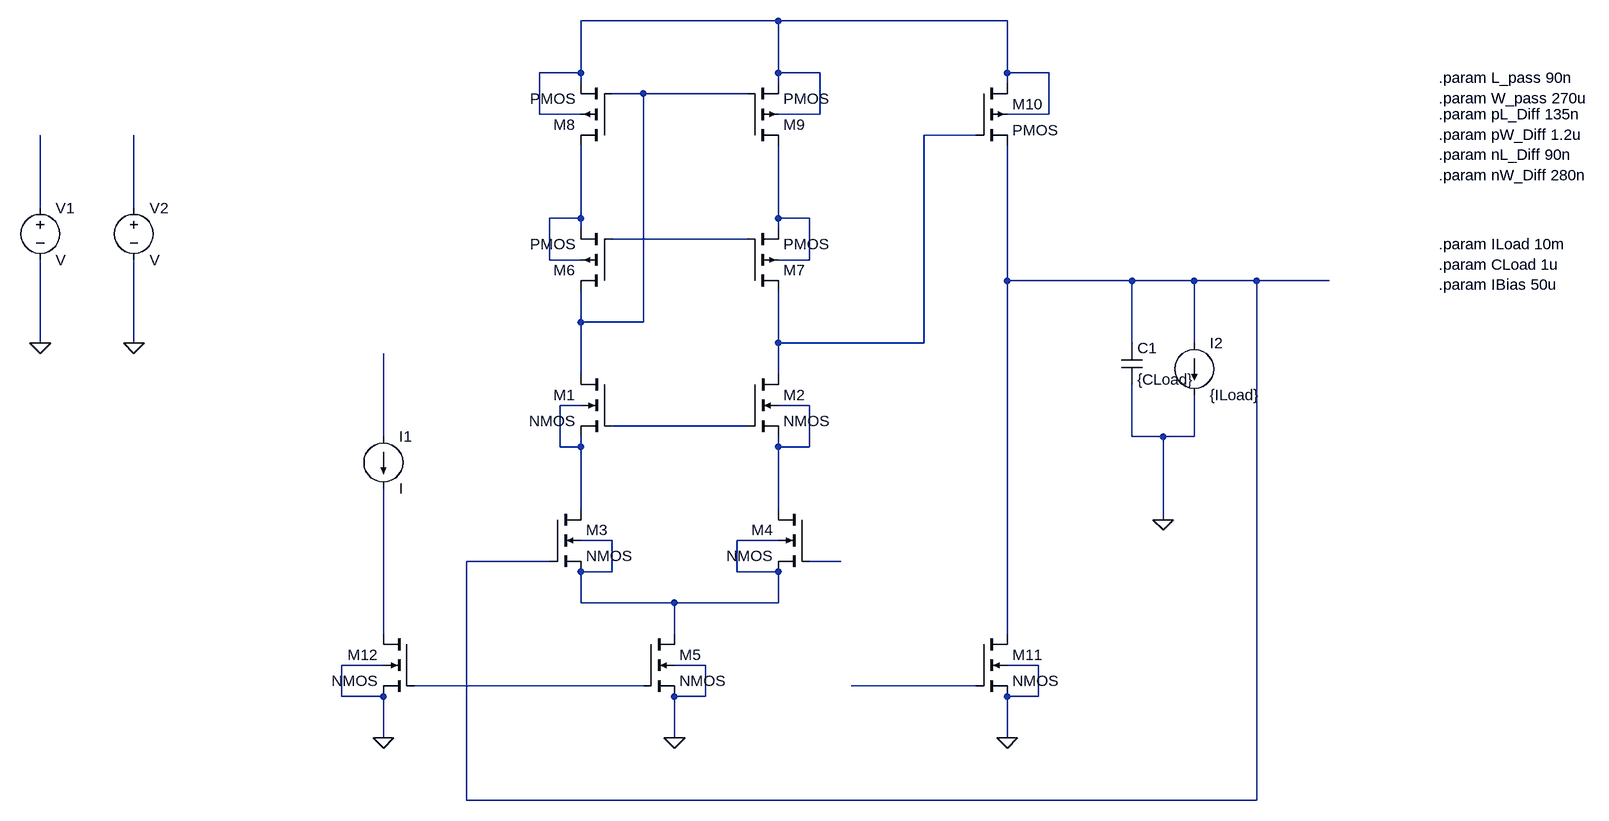
[diagram p0: schematic Draft1.asc]
Draft1.asc, the LTspice schematic file:
Version 4
SHEET 1 1684 836
WIRE 416 -368 112 -368
WIRE 768 -368 416 -368
WIRE 112 -288 112 -368
WIRE 112 -288 48 -288
WIRE 416 -288 416 -368
WIRE 480 -288 416 -288
WIRE 768 -288 768 -368
WIRE 832 -288 768 -288
WIRE 112 -272 112 -288
WIRE 416 -272 416 -288
WIRE 768 -272 768 -288
WIRE 208 -256 160 -256
WIRE 368 -256 208 -256
WIRE 48 -224 48 -288
WIRE 112 -224 48 -224
WIRE 480 -224 480 -288
WIRE 480 -224 416 -224
WIRE 832 -224 832 -288
WIRE 832 -224 768 -224
WIRE 720 -192 640 -192
WIRE -720 -80 -720 -192
WIRE -576 -80 -576 -192
WIRE 112 -64 112 -176
WIRE 112 -64 64 -64
WIRE 416 -64 416 -176
WIRE 464 -64 416 -64
WIRE 112 -48 112 -64
WIRE 416 -48 416 -64
WIRE 368 -32 160 -32
WIRE 64 0 64 -64
WIRE 112 0 64 0
WIRE 464 0 464 -64
WIRE 464 0 416 0
WIRE 768 32 768 -176
WIRE 960 32 768 32
WIRE 1056 32 960 32
WIRE 1152 32 1056 32
WIRE 1264 32 1152 32
WIRE 112 96 112 48
WIRE 208 96 208 -256
WIRE 208 96 112 96
WIRE -720 128 -720 0
WIRE -576 128 -576 0
WIRE 416 128 416 48
WIRE 640 128 640 -192
WIRE 640 128 416 128
WIRE 960 128 960 32
WIRE 1056 128 1056 32
WIRE 112 176 112 96
WIRE 416 176 416 128
WIRE 112 224 80 224
WIRE 464 224 416 224
WIRE 368 256 160 256
WIRE -192 272 -192 144
WIRE 960 272 960 192
WIRE 1008 272 960 272
WIRE 1056 272 1056 208
WIRE 1056 272 1008 272
WIRE 80 288 80 224
WIRE 112 288 112 272
WIRE 112 288 80 288
WIRE 416 288 416 272
WIRE 464 288 464 224
WIRE 464 288 416 288
WIRE 112 384 112 288
WIRE 416 384 416 288
WIRE 1008 400 1008 272
WIRE 160 432 112 432
WIRE 416 432 352 432
WIRE 64 464 -64 464
WIRE 512 464 464 464
WIRE 160 480 160 432
WIRE 160 480 112 480
WIRE 352 480 352 432
WIRE 416 480 352 480
WIRE 112 528 112 480
WIRE 256 528 112 528
WIRE 416 528 416 480
WIRE 416 528 256 528
WIRE -192 576 -192 352
WIRE 256 576 256 528
WIRE 768 576 768 32
WIRE -192 624 -256 624
WIRE 304 624 256 624
WIRE 816 624 768 624
WIRE 208 656 -144 656
WIRE 720 656 528 656
WIRE -256 672 -256 624
WIRE -192 672 -256 672
WIRE 304 672 304 624
WIRE 304 672 256 672
WIRE 816 672 816 624
WIRE 816 672 768 672
WIRE -192 736 -192 672
WIRE 256 736 256 672
WIRE 768 736 768 672
WIRE -64 832 -64 464
WIRE 1152 832 1152 32
WIRE 1152 832 -64 832
FLAG 256 736 0
FLAG 768 736 0
FLAG -192 736 0
FLAG 1008 400 0
FLAG -720 128 0
FLAG -576 128 0
SYMBOL nmos4 160 176 M0
SYMATTR InstName M1
SYMATTR Value2 l={nL_Diff} w={nW_Diff}
SYMBOL nmos4 368 176 R0
SYMATTR InstName M2
SYMATTR Value2 l={nL_Diff} w={nW_Diff}
SYMBOL nmos4 64 384 R0
SYMATTR InstName M3
SYMATTR Value2 l={nL_Diff} w={nW_Diff}
SYMBOL nmos4 464 384 M0
SYMATTR InstName M4
SYMATTR Value2 l={nL_Diff} w={nW_Diff}
SYMBOL nmos4 208 576 R0
SYMATTR InstName M5
SYMBOL pmos4 160 48 R180
SYMATTR InstName M6
SYMATTR Value2 l={pL_Diff} w={pW_Diff}
SYMBOL pmos4 368 48 M180
SYMATTR InstName M7
SYMATTR Value2 l={pL_Diff} w={pW_Diff}
SYMBOL pmos4 160 -176 R180
SYMATTR InstName M8
SYMATTR Value2 l={pL_Diff} w={pW_Diff}
SYMBOL pmos4 368 -176 M180
SYMATTR InstName M9
SYMATTR Value2 l={pL_Diff} w={pW_Diff}
SYMBOL pmos4 720 -272 R0
SYMATTR InstName M10
SYMATTR Value2 l=L_pass w=W_pass
SYMBOL nmos4 720 576 R0
SYMATTR InstName M11
SYMBOL nmos4 -144 576 M0
SYMATTR InstName M12
SYMBOL current -192 272 R0
SYMATTR InstName I1
SYMBOL cap 944 128 R0
SYMATTR InstName C1
SYMATTR Value {CLoad}
SYMBOL current 1056 128 R0
WINDOW 123 0 0 Left 0
WINDOW 39 0 0 Left 0
SYMATTR InstName I2
SYMATTR Value {ILoad}
SYMBOL voltage -720 -96 R0
SYMATTR InstName V1
SYMBOL voltage -576 -96 R0
SYMATTR InstName V2
TEXT 1432 -24 Left 2 !.param ILoad 10m\n.param CLoad 1u\n.param IBias 50u
TEXT 1432 -224 Left 2 !.param pL_Diff 135n\n.param pW_Diff 1.2u\n.param nL_Diff 90n\n.param nW_Diff 280n
TEXT 1432 -280 Left 2 !.param L_pass 90n\n.param W_pass 270u

The netlist it stands for:
* Draft1.asc
M1 N002 N012 N010 N010 NMOS l={nL_Diff} w={nW_Diff}
M2 N003 N012 N011 N011 NMOS l={nL_Diff} w={nW_Diff}
M3 N010 N009 N014 N014 NMOS l={nL_Diff} w={nW_Diff}
M4 N011 N015 N014 N014 NMOS l={nL_Diff} w={nW_Diff}
M5 N014 N017 0 0 NMOS
M6 N002 N008 N006 N006 PMOS l={pL_Diff} w={pW_Diff}
M7 N003 N008 N007 N007 PMOS l={pL_Diff} w={pW_Diff}
M8 N006 N002 N001 N001 PMOS l={pL_Diff} w={pW_Diff}
M9 N007 N002 N001 N001 PMOS l={pL_Diff} w={pW_Diff}
M10 N001 N003 N009 N001 PMOS l=L_pass w=W_pass
M11 N009 N018 0 0 NMOS
M12 N016 N017 0 0 NMOS
I1 N013 N016 I
C1 N009 0 {CLoad}
I2 N009 0 {ILoad}
V1 N004 0 V
V2 N005 0 V
.model NMOS NMOS
.model PMOS PMOS
.lib standard.mos
.param ILoad 10m
.param CLoad 1u
.param IBias 50u
.param pL_Diff 135n
.param pW_Diff 1.2u
.param nL_Diff 90n
.param nW_Diff 280n
.param L_pass 90n
.param W_pass 270u
.backanno
.end